# Altium schematic sheet SIX_OUTPORT.SchDoc
size A3
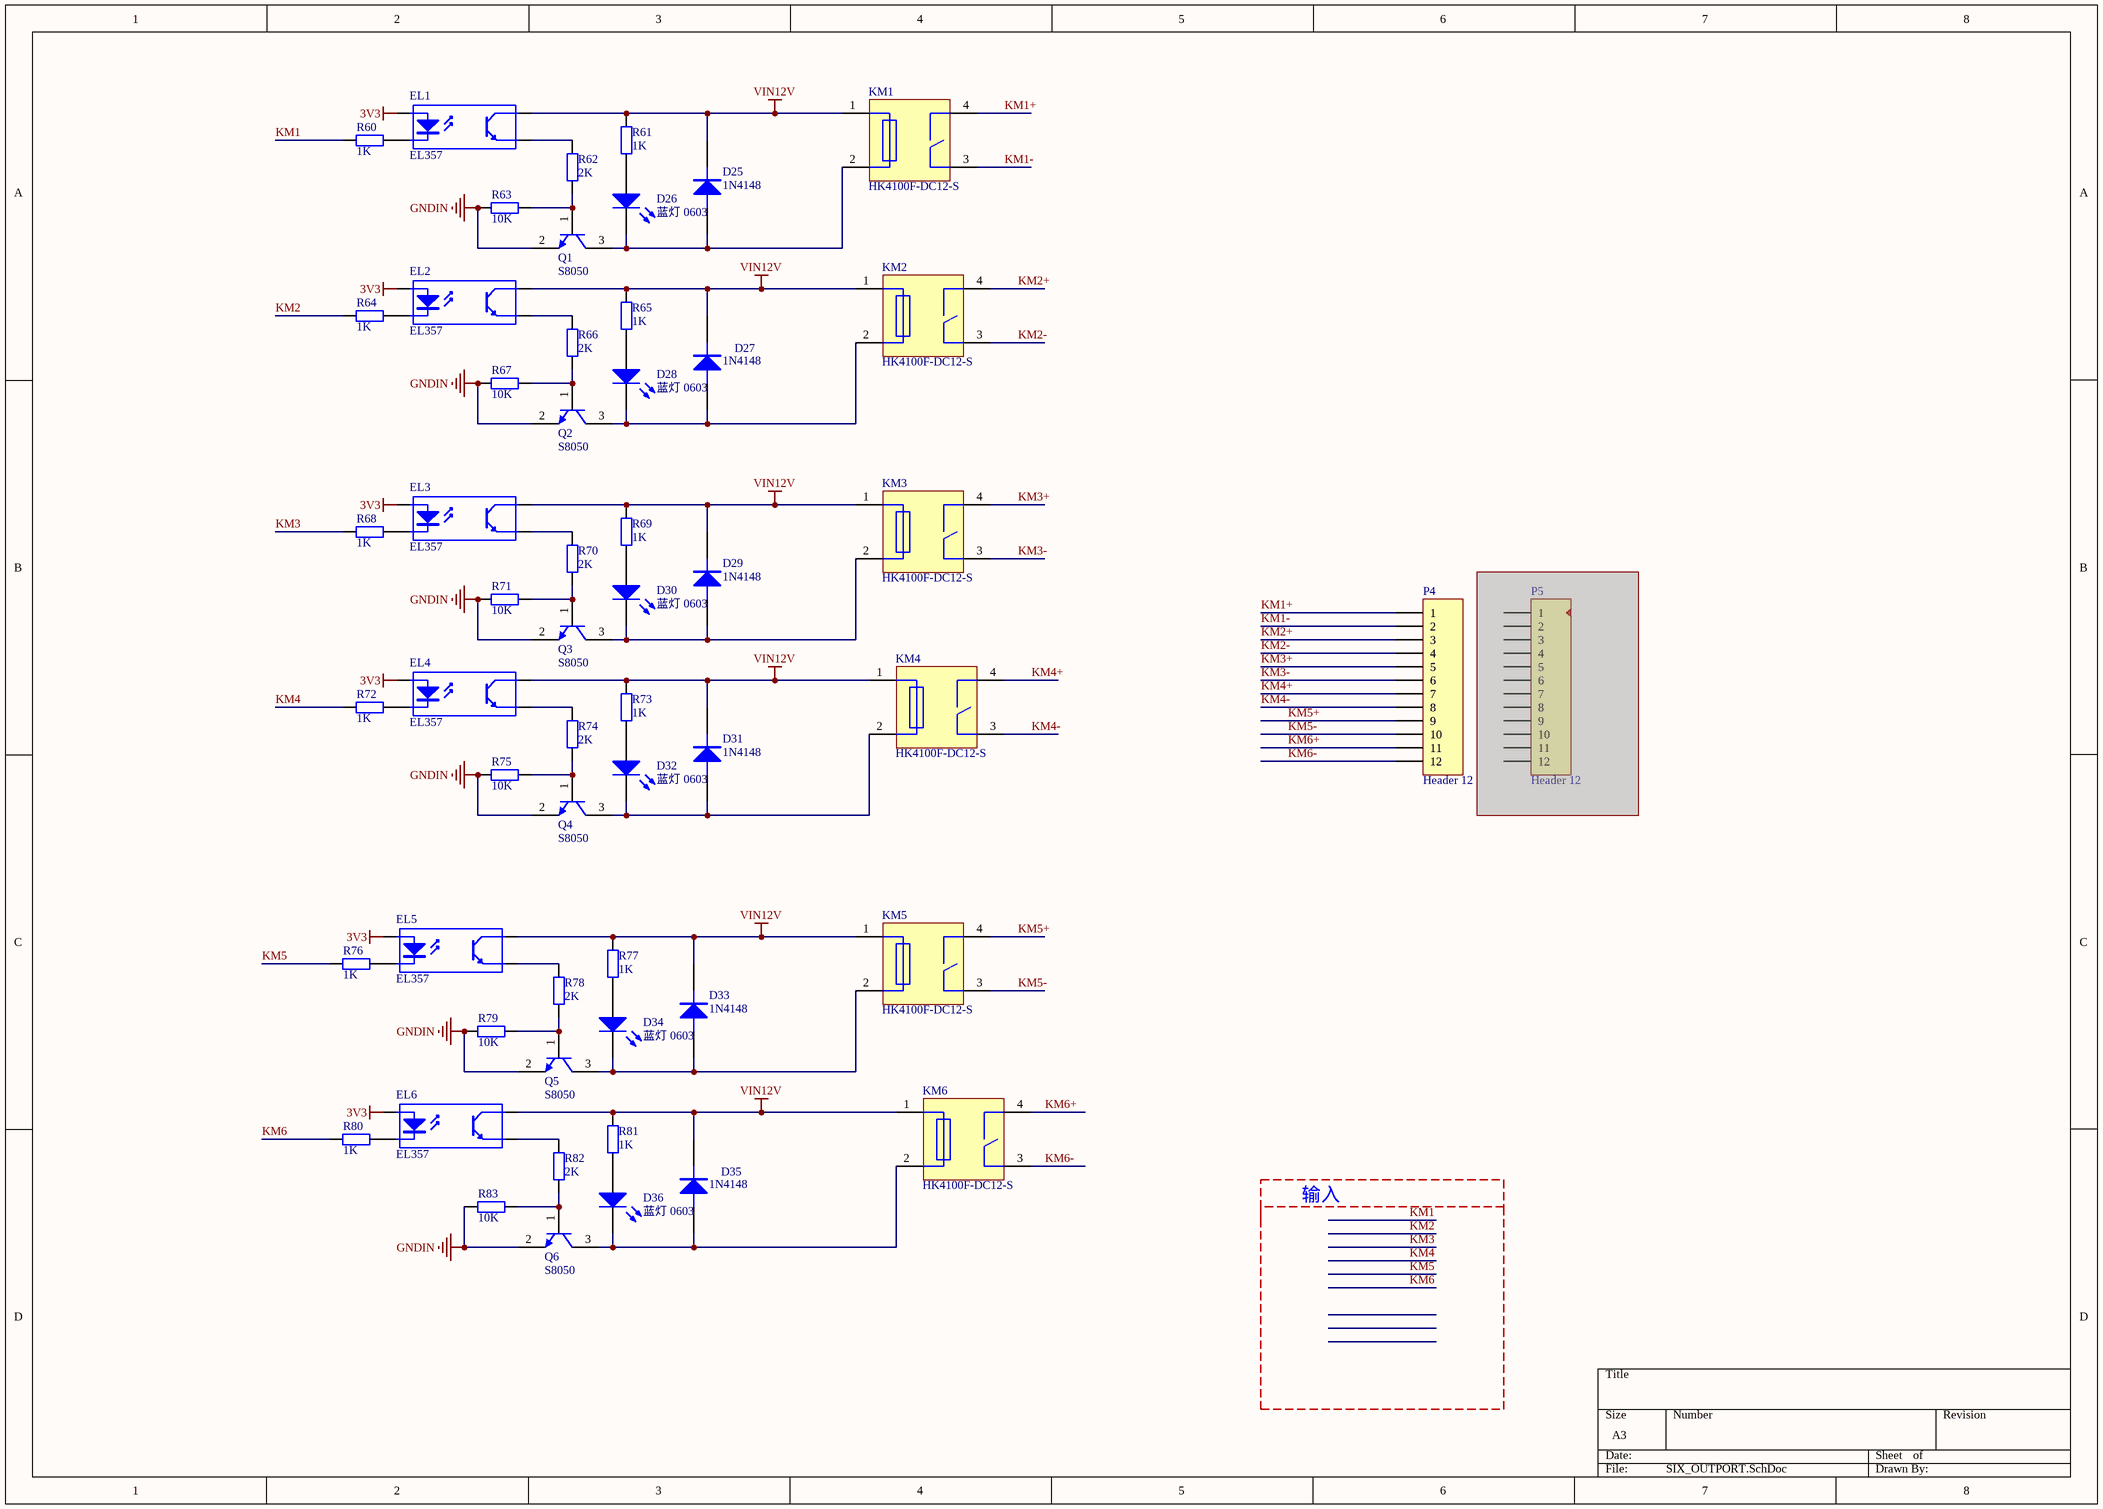
[diagram p0: SIX_OUTPORT.SchDoc]

## Parts
D25  1N4148  [LC-LL-34]
D26  蓝灯 0603  [LC-0603_LED_S1]
D27  1N4148  [LC-LL-34]
D28  蓝灯 0603  [LC-0603_LED_S1]
D29  1N4148  [LC-LL-34]
D30  蓝灯 0603  [LC-0603_LED_S1]
D31  1N4148  [LC-LL-34]
D32  蓝灯 0603  [LC-0603_LED_S1]
D33  1N4148  [LC-LL-34]
D34  蓝灯 0603  [LC-0603_LED_S1]
D35  1N4148  [LC-LL-34]
D36  蓝灯 0603  [LC-0603_LED_S1]
EL1  EL357  [lc-sop-4_P2.54]
EL2  EL357  [lc-sop-4_P2.54]
EL3  EL357  [lc-sop-4_P2.54]
EL4  EL357  [lc-sop-4_P2.54]
EL5  EL357  [lc-sop-4_P2.54]
EL6  EL357  [lc-sop-4_P2.54]
KM1  HK4100F-DC12-S  [JCZ-32F]
KM2  HK4100F-DC12-S  [JCZ-32F]
KM3  HK4100F-DC12-S  [JCZ-32F]
KM4  HK4100F-DC12-S  [JCZ-32F]
KM5  HK4100F-DC12-S  [JCZ-32F]
KM6  HK4100F-DC12-S  [JCZ-32F]
P4  Header 12  [F5.08-12P]
P5  Header 12  [F5.08-12P]  (masked out: inside a compile mask, not in the netlist)
Q1  S8050  [LC-SOT-23(SOT-23-3)]
Q2  S8050  [LC-SOT-23(SOT-23-3)]
Q3  S8050  [LC-SOT-23(SOT-23-3)]
Q4  S8050  [LC-SOT-23(SOT-23-3)]
Q5  S8050  [LC-SOT-23(SOT-23-3)]
Q6  S8050  [LC-SOT-23(SOT-23-3)]
R60  1K  [LC-0603_R]
R61  1K  [LC-0603_R]
R62  2K  [LC-0603_R]
R63  10K  [LC-0603_R]
R64  1K  [LC-0603_R]
R65  1K  [LC-0603_R]
R66  2K  [LC-0603_R]
R67  10K  [LC-0603_R]
R68  1K  [LC-0603_R]
R69  1K  [LC-0603_R]
R70  2K  [LC-0603_R]
R71  10K  [LC-0603_R]
R72  1K  [LC-0603_R]
R73  1K  [LC-0603_R]
R74  2K  [LC-0603_R]
R75  10K  [LC-0603_R]
R76  1K  [LC-0603_R]
R77  1K  [LC-0603_R]
R78  2K  [LC-0603_R]
R79  10K  [LC-0603_R]
R80  1K  [LC-0603_R]
R81  1K  [LC-0603_R]
R82  2K  [LC-0603_R]
R83  10K  [LC-0603_R]

## Nets
3V3: EL1.1(A) EL2.1(A) EL3.1(A) EL4.1(A) EL5.1(A) EL6.1(A)
GNDIN: Q1.2(E) Q2.2(E) Q3.2(E) Q4.2(E) Q5.2(E) Q6.2(E) R63.2 R67.2 R71.2 R75.2 R79.2 R83.2
VIN12V: D25.2(K) D27.2(K) D29.2(K) D31.2(K) D33.2(K) D35.2(K) EL1.4(C) EL2.4(C) EL3.4(C) EL4.4(C) EL5.4(C) EL6.4(C) KM1.1 KM2.1 KM3.1 KM4.1 KM5.1 KM6.1 R61.1 R65.1 R69.1 R73.1 R77.1 R81.1
KM1: R60.2
KM1+: KM1.4 P4.1
KM1-: KM1.3 P4.2
KM2: R64.2
KM2+: KM2.4 P4.3
KM2-: KM2.3 P4.4
KM3: R68.2
KM3+: KM3.4 P4.5
KM3-: KM3.3 P4.6
KM4: R72.2
KM4+: KM4.4 P4.7
KM4-: KM4.3 P4.8
KM5: R76.2
KM5+: KM5.4 P4.9
KM5-: KM5.3 P4.10
KM6: R80.2
KM6+: KM6.4 P4.11
KM6-: KM6.3 P4.12
NetD25_1: D25.1(A) D26.K KM1.2 Q1.3(C)
NetD26_A: D26.A R61.2
NetD27_1: D27.1(A) D28.K KM2.2 Q2.3(C)
NetD28_A: D28.A R65.2
NetD29_1: D29.1(A) D30.K KM3.2 Q3.3(C)
NetD30_A: D30.A R69.2
NetD31_1: D31.1(A) D32.K KM4.2 Q4.3(C)
NetD32_A: D32.A R73.2
NetD33_1: D33.1(A) D34.K KM5.2 Q5.3(C)
NetD34_A: D34.A R77.2
NetD35_1: D35.1(A) D36.K KM6.2 Q6.3(C)
NetD36_A: D36.A R81.2
NetEL1_2: EL1.2(K) R60.1
NetEL1_3: EL1.3(E) R62.2
NetEL2_2: EL2.2(K) R64.1
NetEL2_3: EL2.3(E) R66.2
NetEL3_2: EL3.2(K) R68.1
NetEL3_3: EL3.3(E) R70.2
NetEL4_2: EL4.2(K) R72.1
NetEL4_3: EL4.3(E) R74.2
NetEL5_2: EL5.2(K) R76.1
NetEL5_3: EL5.3(E) R78.2
NetEL6_2: EL6.2(K) R80.1
NetEL6_3: EL6.3(E) R82.2
NetQ1_1: Q1.1(B) R62.1 R63.1
NetQ2_1: Q2.1(B) R66.1 R67.1
NetQ3_1: Q3.1(B) R70.1 R71.1
NetQ4_1: Q4.1(B) R74.1 R75.1
NetQ5_1: Q5.1(B) R78.1 R79.1
NetQ6_1: Q6.1(B) R82.1 R83.1

## Notes on the sheet
- 输入

## Library data of the parts
D25 D27 D29 D31 D33 D35 = DIODE
D26 D28 D30 D32 D34 D36 = 0: 发光二极管; ComponentLink1Description: 供应商链接; ComponentLink1URL: http://www.szlcsc.com/product/details_73150.html; Package: 0603; Supplier: LC; SuppliersPartNumber: C72041
EL1-EL6 = ST188: 反射式光电传感器; Published: 24-Mar-1999; LatestRevisionDate: 04-Mar-2005; LatestRevisionNote: Sch pins 3 & 4 Swapped.; DatasheetDocument: Nov-2003; PackageReference: DIP-4; Publisher: Altium Limited
KM1-KM6 = R: 单刀双掷继电器
P4 = Header 12: Header, 12-Pin; LatestRevisionDate: 17-Jul-2002; LatestRevisionNote: Re-released for DXP Platform.; Publisher: Altium Limited
R60-R83 = Res2: Resistor; Published: 8-Jun-2000; LatestRevisionDate: 17-Jul-2002; LatestRevisionNote: Re-released for DXP Platform.; PackageReference: AXIAL-0.4; Publisher: Altium Limited
  R60 R61 R64 R65 R68 R69 R72 R73 R76 R77 R80 R81: Value: 1K
  R62 R66 R70 R74 R78 R82: Value: 2K
  R63 R67 R71 R75 R79 R83: Value: 10K